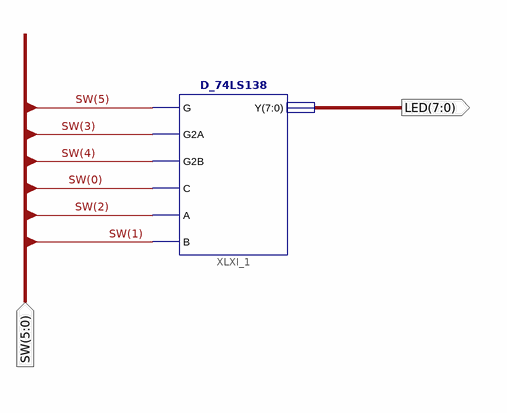
[diagram p0: schematic sheet 1]
// Xilinx ISE schematic D_74LS138_Test.sch (kintex7) as structural Verilog: 1 symbols, 2 ports
module D_74LS138_Test (
  input  [5:0] SW,
  output [7:0] LED
);

  D_74LS138 XLXI_1 (.G(SW[5]), .G2A(SW[3]), .G2B(SW[4]), .C(SW[0]), .A(SW[2]), .B(SW[1]), .Y(LED));
endmodule
